# EasyEDA schematic schematic.json
TITLE: Sheet_1; REV: 1.0; Date: 2026-05-26; Sheet: 1/1; Drawn By: ondori38; Company: Your Company
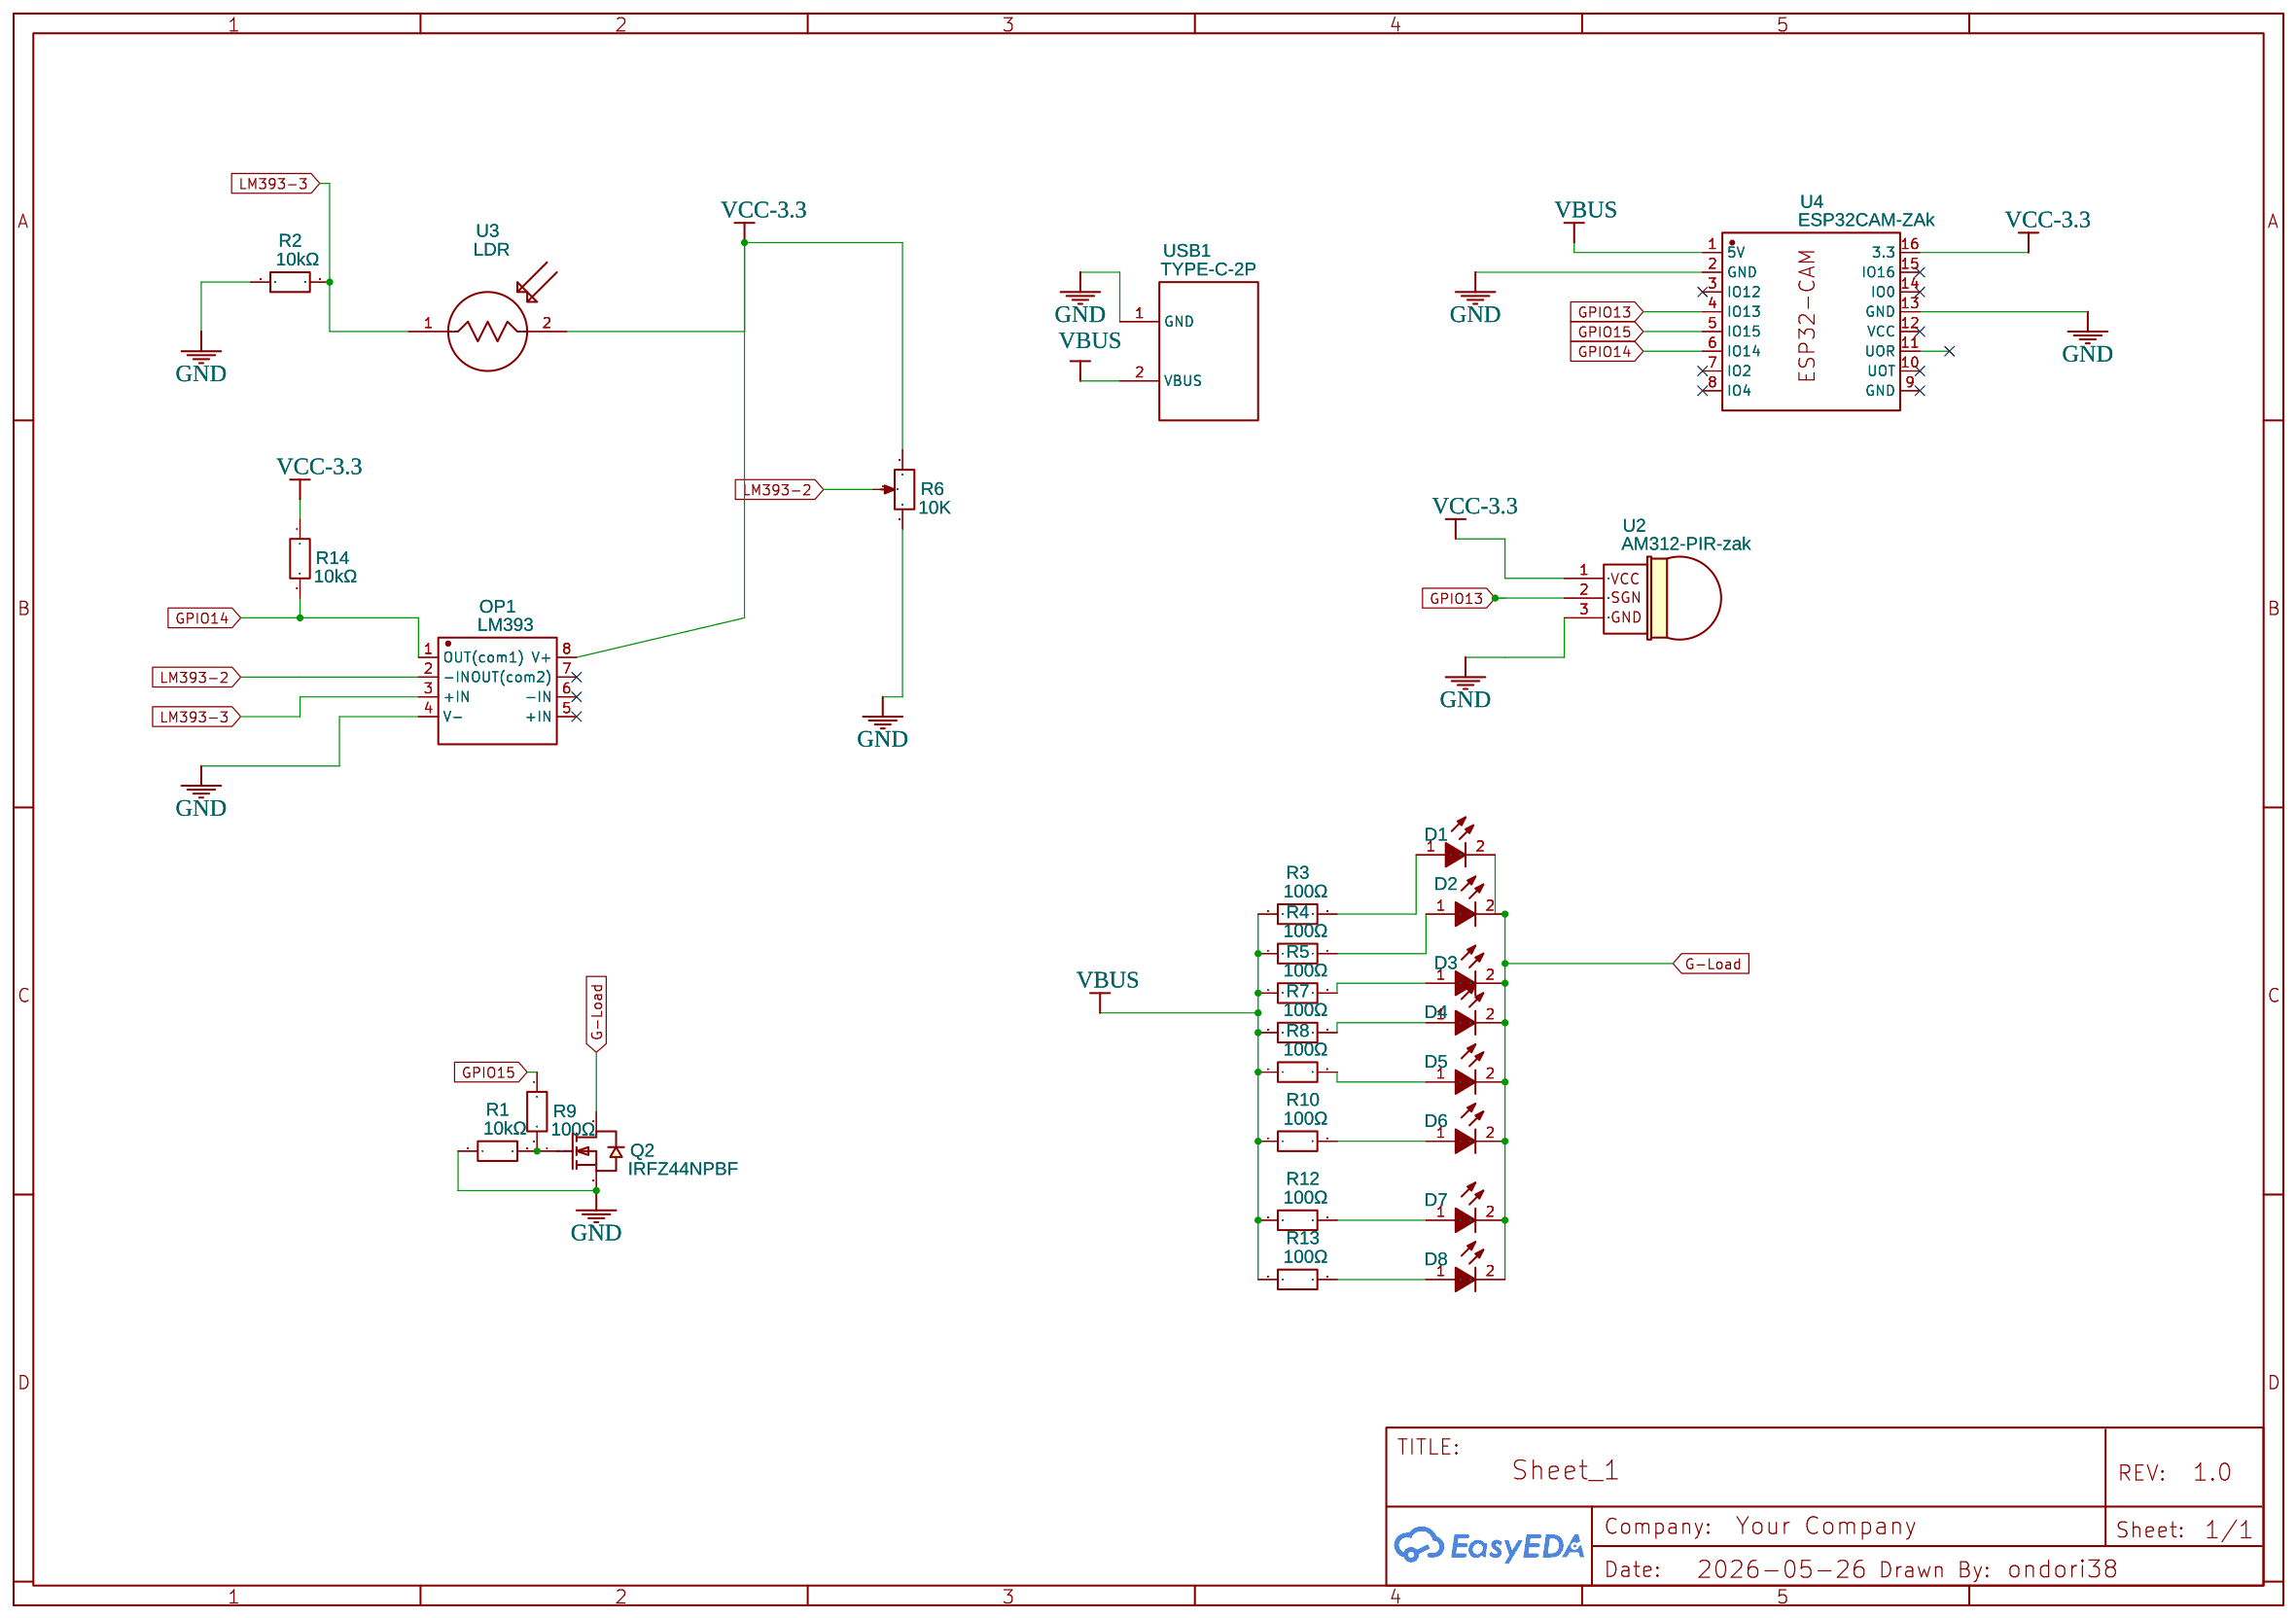
[diagram p0: schematic sheet]

## Parts
D1  LED 2MM  [LED-TH_LED-DP2-2LED-AMCC]
D2  LED 2MM  [LED-TH_LED-DP2-2LED-AMCC]
D3  LED 2MM  [LED-TH_LED-DP2-2LED-AMCC]
D4  LED 2MM  [LED-TH_LED-DP2-2LED-AMCC]
D5  LED 2MM  [LED-TH_LED-DP2-2LED-AMCC]
D6  LED 2MM  [LED-TH_LED-DP2-2LED-AMCC]
D7  LED 2MM  [LED-TH_LED-DP2-2LED-AMCC]
D8  LED 2MM  [LED-TH_LED-DP2-2LED-AMCC]
OP1  LM393  [DIP-8 (LM393)]
Q2  IRFZ44NPBF  [TO-220-3_L10.0-W4.5-P2.54-L]
R1  10kΩ  [R1206]
R2  10kΩ  [R1206]
R3  100Ω  [R1206]
R4  100Ω  [R1206]
R5  100Ω  [R1206]
R6  10K  [RES-ADJ-TH_3296W]
R7  100Ω  [R1206]
R8  100Ω  [R1206]
R9  100Ω  [R1206]
R10  100Ω  [R1206]
R12  100Ω  [R1206]
R13  100Ω  [R1206]
R14  10kΩ  [R1206]
U2  AM312-PIR-zak  [AM312-PIR-ZAK]
U3  LDR  [LDR (LDRSC058S)]
U4  ESP32CAM-ZAk  [ESP32CAM-ZAK]
USB1  TYPE-C-2P  [TYPE-C-2P]

## Library data of the parts
D1-D8 = LED 2MM: Supplier: Digi-Key; Manufacturer: VccLite; Manufacturer Part: 5600; Supplier Part: L20325-ND; link: https://vcclite.com/product/5602f5-5v/; Contributor: rivithpc
OP1 = LM393: Contributor: sohail.hdesign
Q2 = IRFZ44NPBF: Supplier: LCSC; Manufacturer: Infineon(英飞凌); Supplier Part: C2586; JLCPCB Part Class: Extended Part
R1-R5 R7-R10 R12-R14 = SCR1206F68K: Contributor: lcsc; Supplier: LCSC; Supplier Part: C3017065; Manufacturer: VO(翔胜); JLCPCB Part Class: Extended Part
R6 = 3296W-1-103_C330432: Supplier: LCSC; Supplier Part: C330432; Manufacturer: Chengdu Guosheng Tech; Manufacturer Part: 3296W-1-103; Contributor: argiroprat.bratslav
U2 = AM312-PIR-zak: Supplier: LCSC; Contributor: ondori38
U3 = LDR: Contributor: william_lim
U4 = ESP32_CAM: Contributor: ondori38
USB1 = TYPE-C-2P: Contributor: alxm

## Nets
GND: OP1.4(V-) Q2.3(S) R1.1 R2.1 R6.3 U2.3 U4.2(GND) U4.13(GND) USB1.1(GND)
VBUS: R3.1 R4.1 R5.1 R7.1 R8.1 R10.1 R12.1 R13.1 U4.1(5V) USB1.2(VBUS)
VCC-3.3: OP1.8(V+) R6.1 R14.1 U2.1 U3.2 U4.16(3.3)
G-Load: D1.2(K) D2.2(K) D3.2(K) D4.2(K) D5.2(K) D6.2(K) D7.2(K) D8.2(K) Q2.2(D)
GPIO13: U2.2 U4.4(IO13)
GPIO14: OP1.1(OUT(com1)) R14.2 U4.6(IO14)
GPIO15: R9.1 U4.5(IO15)
LM393-2: OP1.2(-IN) R6.2
LM393-3: OP1.3(+IN) R2.2 U3.1
Net-(D1-1): D1.1(A) R3.2
Net-(D2-1): D2.1(A) R4.2
Net-(D3-1): D3.1(A) R5.2
Net-(D4-1): D4.1(A) R7.2
Net-(D5-1): D5.1(A) R8.2
Net-(D6-1): D6.1(A) R10.2
Net-(D7-1): D7.1(A) R12.2
Net-(D8-1): D8.1(A) R13.2
Net-(Q2-1): Q2.1(G) R1.2 R9.2

Not connected (* = marked no-connect by the designer): OP1 5(+IN)* 6(-IN)* 7(OUT(com2))*; U4 3(IO12)* 7(IO2)* 8(IO4)* 9(GND)* 10(UOT)* 11(UOR) 12(VCC)* 14(IO0)* 15(IO16)*
